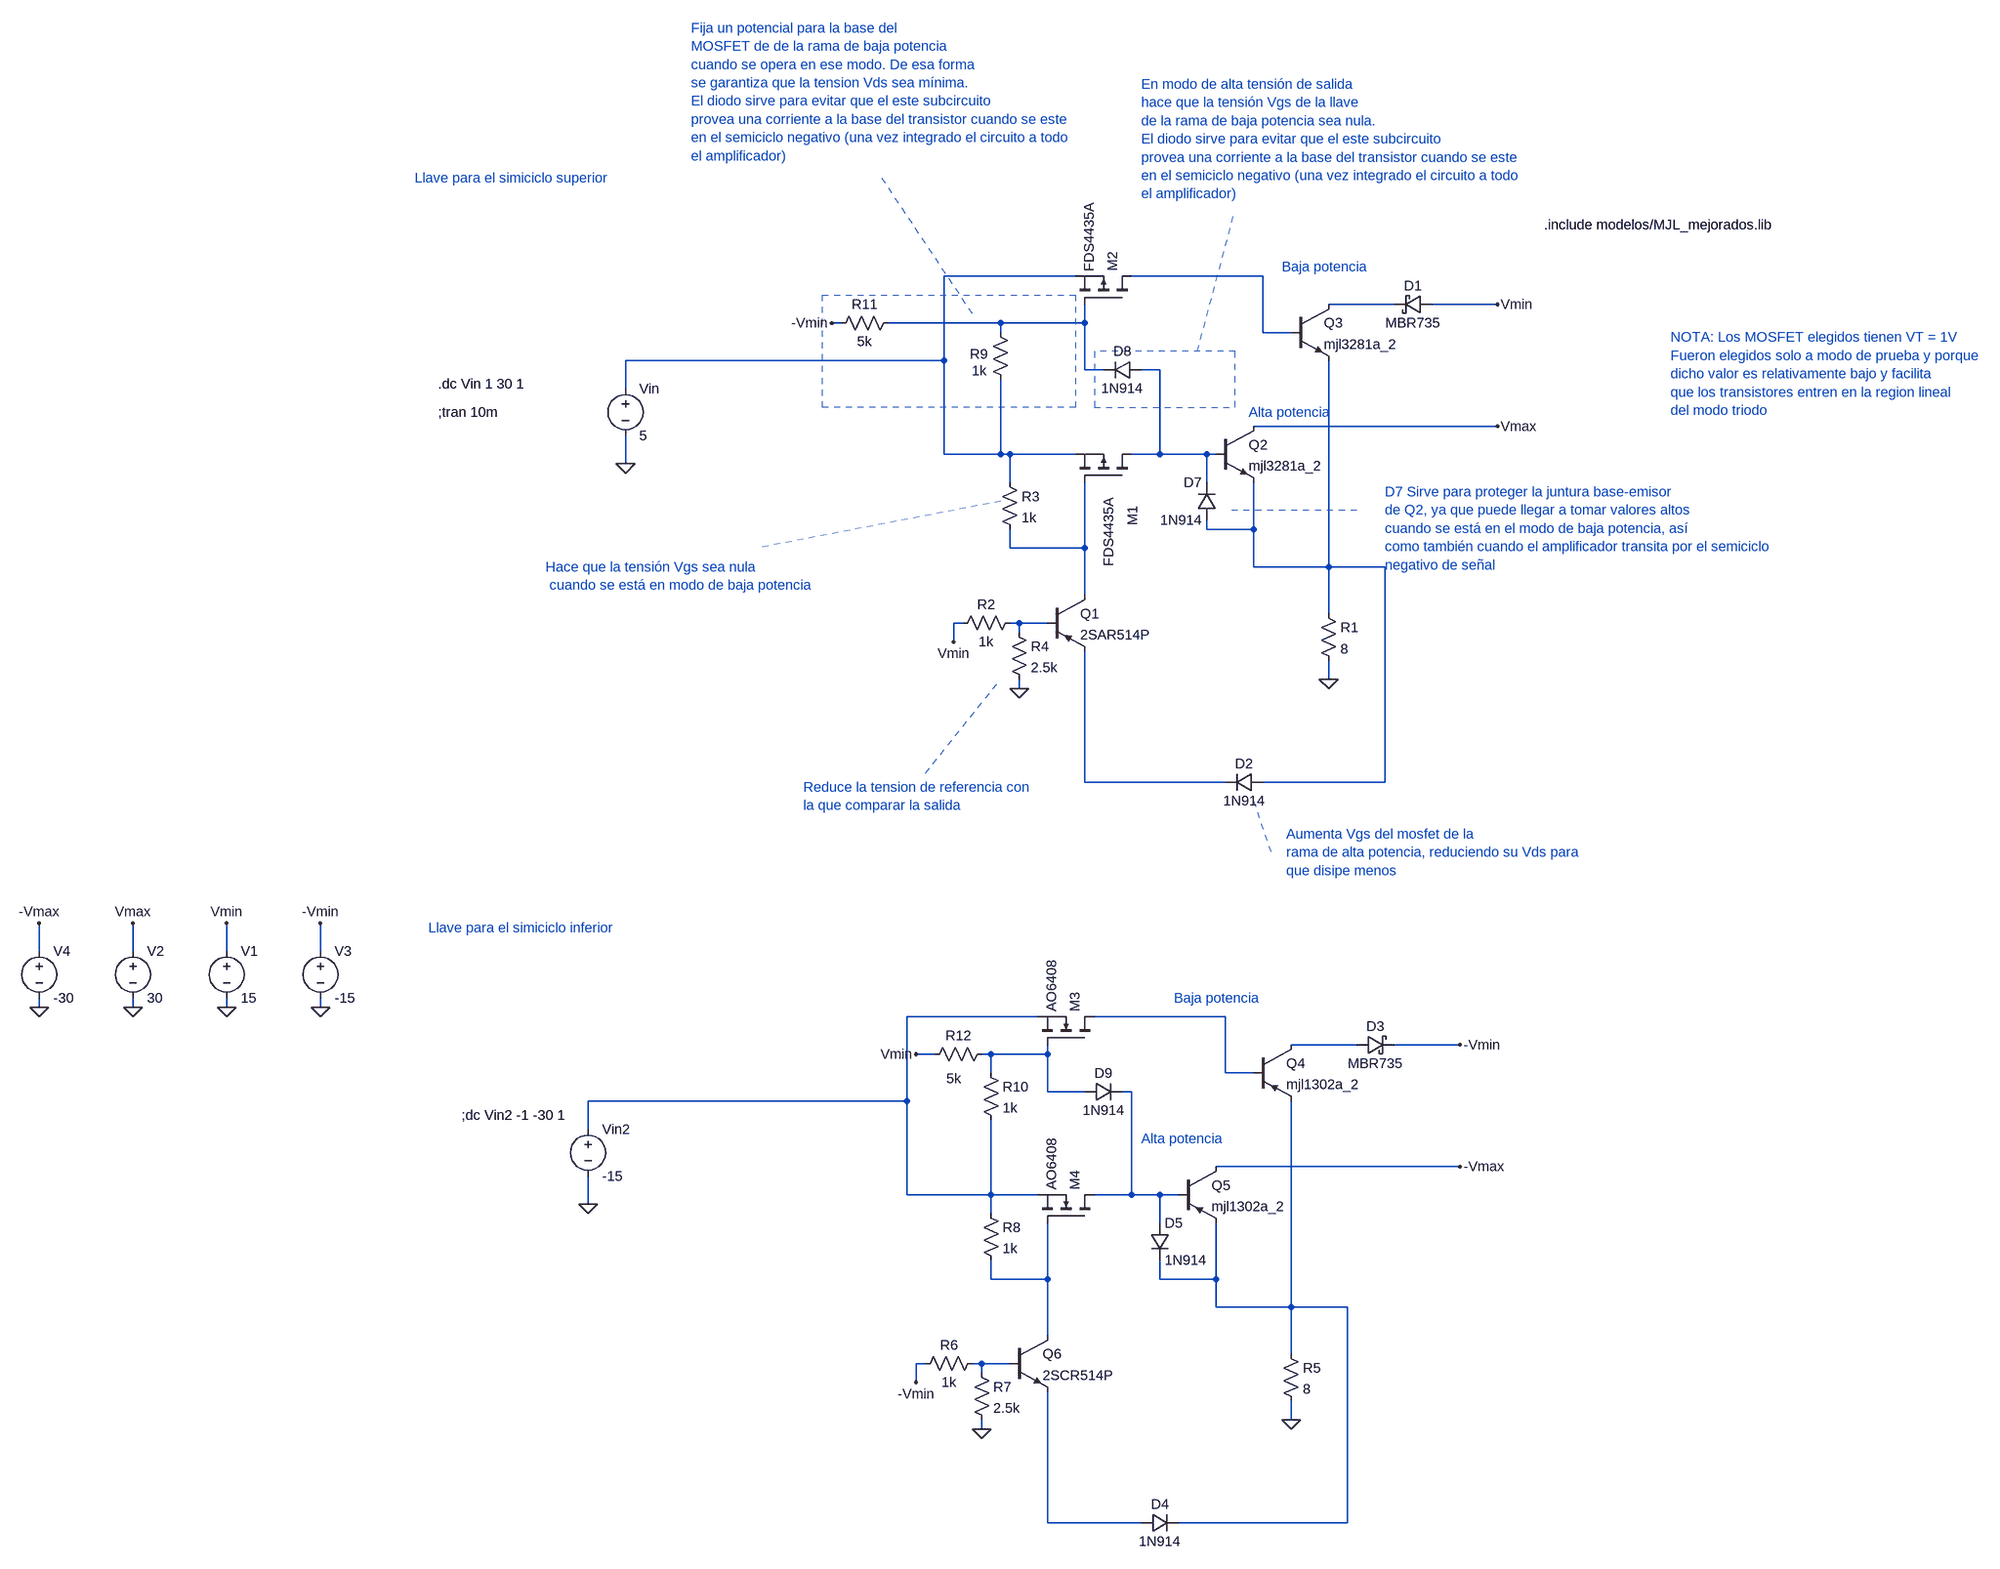
[diagram p0: schematic prueba_llaves_ambos_semiciclos.asc]
prueba_llaves_ambos_semiciclos.asc, the LTspice schematic file:
Version 4
SHEET 1 3400 1488
WIRE 1824 -688 1600 -688
WIRE 2144 -688 1920 -688
WIRE 2368 -640 2256 -640
WIRE 2544 -640 2432 -640
WIRE 1424 -608 1408 -608
WIRE 1696 -608 1504 -608
WIRE 1840 -608 1840 -640
WIRE 1840 -608 1696 -608
WIRE 1696 -592 1696 -608
WIRE 2144 -592 2144 -688
WIRE 2192 -592 2144 -592
WIRE 1600 -544 1600 -688
WIRE 1600 -544 1056 -544
WIRE 1840 -528 1840 -608
WIRE 1872 -528 1840 -528
WIRE 1968 -528 1936 -528
WIRE 1056 -496 1056 -544
WIRE 2544 -432 2128 -432
WIRE 1600 -384 1600 -544
WIRE 1696 -384 1696 -512
WIRE 1696 -384 1600 -384
WIRE 1712 -384 1696 -384
WIRE 1824 -384 1712 -384
WIRE 1968 -384 1968 -528
WIRE 1968 -384 1920 -384
WIRE 2048 -384 1968 -384
WIRE 2064 -384 2048 -384
WIRE 1056 -368 1056 -416
WIRE 1712 -336 1712 -384
WIRE 2048 -336 2048 -384
WIRE 2048 -256 2048 -272
WIRE 2128 -256 2128 -336
WIRE 2128 -256 2048 -256
WIRE 1712 -224 1712 -256
WIRE 1840 -224 1840 -336
WIRE 1840 -224 1712 -224
WIRE 2128 -192 2128 -256
WIRE 2256 -192 2256 -544
WIRE 2256 -192 2128 -192
WIRE 2352 -192 2256 -192
WIRE 1840 -144 1840 -224
WIRE 2256 -112 2256 -192
WIRE 1632 -96 1616 -96
WIRE 1728 -96 1712 -96
WIRE 1776 -96 1728 -96
WIRE 1728 -80 1728 -96
WIRE 1616 -64 1616 -96
WIRE 2256 0 2256 -32
WIRE 1728 16 1728 0
WIRE 1840 176 1840 -48
WIRE 2080 176 1840 176
WIRE 2352 176 2352 -192
WIRE 2352 176 2144 176
WIRE -128 464 -128 416
WIRE 32 464 32 416
WIRE 192 464 192 416
WIRE 352 464 352 416
WIRE -128 560 -128 544
WIRE 32 560 32 544
WIRE 192 560 192 544
WIRE 352 560 352 544
WIRE 1760 576 1536 576
WIRE 2080 576 1856 576
WIRE 2304 624 2192 624
WIRE 2480 624 2368 624
WIRE 1584 640 1552 640
WIRE 1680 640 1664 640
WIRE 1776 640 1776 624
WIRE 1776 640 1680 640
WIRE 1680 672 1680 640
WIRE 2080 672 2080 576
WIRE 2128 672 2080 672
WIRE 1776 704 1776 640
WIRE 1840 704 1776 704
WIRE 1920 704 1904 704
WIRE 1536 720 1536 576
WIRE 1536 720 992 720
WIRE 992 768 992 720
WIRE 2480 832 2064 832
WIRE 1536 880 1536 720
WIRE 1680 880 1680 752
WIRE 1680 880 1536 880
WIRE 1760 880 1680 880
WIRE 1920 880 1920 704
WIRE 1920 880 1856 880
WIRE 1968 880 1920 880
WIRE 2000 880 1968 880
WIRE 992 896 992 848
WIRE 1680 912 1680 880
WIRE 1968 928 1968 880
WIRE 1680 1024 1680 992
WIRE 1776 1024 1776 928
WIRE 1776 1024 1680 1024
WIRE 1968 1024 1968 992
WIRE 2064 1024 2064 928
WIRE 2064 1024 1968 1024
WIRE 2064 1072 2064 1024
WIRE 2192 1072 2192 720
WIRE 2192 1072 2064 1072
WIRE 2288 1072 2192 1072
WIRE 1776 1120 1776 1024
WIRE 2192 1152 2192 1072
WIRE 1568 1168 1552 1168
WIRE 1664 1168 1648 1168
WIRE 1712 1168 1664 1168
WIRE 1664 1184 1664 1168
WIRE 1552 1200 1552 1168
WIRE 2192 1264 2192 1232
WIRE 1664 1280 1664 1264
WIRE 1776 1440 1776 1216
WIRE 1936 1440 1776 1440
WIRE 2288 1440 2288 1072
WIRE 2288 1440 2000 1440
FLAG 192 560 0
FLAG 192 416 Vmin
FLAG 32 416 Vmax
FLAG 32 560 0
FLAG 352 560 0
FLAG 352 416 -Vmin
FLAG -128 416 -Vmax
FLAG -128 560 0
FLAG 2256 0 0
FLAG 1056 -368 0
FLAG 2544 -640 Vmin
FLAG 2544 -432 Vmax
FLAG 1616 -64 Vmin
FLAG 1728 16 0
FLAG 2192 1264 0
FLAG 992 896 0
FLAG 2480 624 -Vmin
FLAG 2480 832 -Vmax
FLAG 1552 1200 -Vmin
FLAG 1664 1280 0
FLAG 1408 -608 -Vmin
FLAG 1552 640 Vmin
SYMBOL voltage 192 448 R0
WINDOW 123 0 0 Left 0
WINDOW 39 0 0 Left 0
SYMATTR InstName V1
SYMATTR Value 15
SYMBOL voltage 32 448 R0
WINDOW 123 0 0 Left 0
WINDOW 39 0 0 Left 0
SYMATTR InstName V2
SYMATTR Value 30
SYMBOL voltage 352 448 R0
WINDOW 123 0 0 Left 0
WINDOW 39 0 0 Left 0
SYMATTR InstName V3
SYMATTR Value -15
SYMBOL voltage -128 448 R0
WINDOW 123 0 0 Left 0
WINDOW 39 0 0 Left 0
SYMATTR InstName V4
SYMATTR Value -30
SYMBOL pmos 1920 -336 M270
WINDOW 0 -74 -2 Left 2
WINDOW 3 -144 39 Left 2
SYMATTR InstName M1
SYMATTR Value FDS4435A
SYMBOL pmos 1920 -640 M270
SYMATTR InstName M2
SYMATTR Value FDS4435A
SYMBOL pnp 1776 -144 R0
SYMATTR InstName Q1
SYMATTR Value 2SAR514P
SYMBOL res 2240 -128 R0
SYMATTR InstName R1
SYMATTR Value 8
SYMBOL voltage 1056 -512 R0
WINDOW 123 0 0 Left 0
WINDOW 39 0 0 Left 0
SYMATTR InstName Vin
SYMATTR Value 5
SYMBOL npn 2064 -432 R0
SYMATTR InstName Q2
SYMATTR Value mjl3281a_2
SYMBOL npn 2192 -640 R0
SYMATTR InstName Q3
SYMATTR Value mjl3281a_2
SYMBOL res 1728 -112 R90
WINDOW 0 0 56 VBottom 2
WINDOW 3 32 56 VTop 2
SYMATTR InstName R2
SYMATTR Value 1k
SYMBOL res 1696 -352 R0
SYMATTR InstName R3
SYMATTR Value 1k
SYMBOL schottky 2432 -656 R90
WINDOW 0 0 32 VBottom 2
WINDOW 3 32 32 VTop 2
SYMATTR InstName D1
SYMATTR Value MBR735
SYMATTR Description Diode
SYMATTR Type diode
SYMBOL res 1712 -96 R0
SYMATTR InstName R4
SYMATTR Value 2.5k
SYMBOL res 2176 1136 R0
SYMATTR InstName R5
SYMATTR Value 8
SYMBOL voltage 992 752 R0
WINDOW 123 0 0 Left 0
WINDOW 39 0 0 Left 0
SYMATTR InstName Vin2
SYMATTR Value -15
SYMBOL res 1664 1152 R90
WINDOW 0 0 56 VBottom 2
WINDOW 3 32 56 VTop 2
SYMATTR InstName R6
SYMATTR Value 1k
SYMBOL schottky 2304 640 R270
WINDOW 0 32 32 VTop 2
WINDOW 3 0 32 VBottom 2
SYMATTR InstName D3
SYMATTR Value MBR735
SYMATTR Description Diode
SYMATTR Type diode
SYMBOL res 1648 1168 R0
SYMATTR InstName R7
SYMATTR Value 2.5k
SYMBOL pnp 2128 624 R0
SYMATTR InstName Q4
SYMATTR Value mjl1302a_2
SYMBOL pnp 2000 832 R0
SYMATTR InstName Q5
SYMATTR Value mjl1302a_2
SYMBOL nmos 1856 624 M270
SYMATTR InstName M3
SYMATTR Value AO6408
SYMBOL nmos 1856 928 M270
SYMATTR InstName M4
SYMATTR Value AO6408
SYMBOL res 1664 896 R0
SYMATTR InstName R8
SYMATTR Value 1k
SYMBOL npn 1712 1120 R0
SYMATTR InstName Q6
SYMATTR Value 2SCR514P
SYMBOL diode 2144 160 R90
WINDOW 0 0 32 VBottom 2
WINDOW 3 32 32 VTop 2
SYMATTR InstName D2
SYMATTR Value 1N914
SYMBOL res 1680 -608 R0
WINDOW 0 -36 53 Left 2
WINDOW 3 -33 81 Left 2
SYMATTR InstName R9
SYMATTR Value 1k
SYMBOL res 1664 656 R0
SYMATTR InstName R10
SYMATTR Value 1k
SYMBOL diode 1936 1456 R270
WINDOW 0 32 32 VTop 2
WINDOW 3 0 32 VBottom 2
SYMATTR InstName D4
SYMATTR Value 1N914
SYMBOL res 1520 -624 R90
WINDOW 0 0 56 VBottom 2
WINDOW 3 32 56 VTop 2
SYMATTR InstName R11
SYMATTR Value 5k
SYMBOL res 1680 624 R90
WINDOW 0 0 56 VBottom 2
WINDOW 3 42 63 VTop 2
SYMATTR InstName R12
SYMATTR Value 5k
SYMBOL diode 2064 -272 R180
WINDOW 0 24 64 Left 2
WINDOW 3 24 0 Left 2
SYMATTR InstName D7
SYMATTR Value 1N914
SYMBOL diode 1936 -544 R90
WINDOW 0 0 32 VBottom 2
WINDOW 3 32 32 VTop 2
SYMATTR InstName D8
SYMATTR Value 1N914
SYMBOL diode 1840 720 R270
WINDOW 0 32 32 VTop 2
WINDOW 3 0 32 VBottom 2
SYMATTR InstName D9
SYMATTR Value 1N914
SYMBOL diode 1952 928 R0
SYMATTR InstName D5
SYMATTR Value 1N914
TEXT 736 -456 Left 2 !;tran 10m
TEXT 2176 -704 Left 2 ;Baja potencia
TEXT 2120 -456 Left 2 ;Alta potencia
TEXT 2624 -776 Left 2 !.include modelos/MJL_mejorados.lib
TEXT 736 -504 Left 2 !.dc Vin 1 30 1
TEXT 1992 544 Left 2 ;Baja potencia
TEXT 1936 784 Left 2 ;Alta potencia
TEXT 776 744 Left 2 !;dc Vin2 -1 -30 1
TEXT 696 -856 Left 2 ;Llave para el simiciclo superior
TEXT 720 424 Left 2 ;Llave para el simiciclo inferior
TEXT 1360 184 Left 2 ;Reduce la tension de referencia con\nla que comparar la salida
TEXT 920 -192 Left 2 ;Hace que la tensión Vgs sea nula\n cuando se está en modo de baja potencia
TEXT 1936 -1016 Left 2 ;En modo de alta tensión de salida\nhace que la tensión Vgs de la llave\nde la rama de baja potencia sea nula.\nEl diodo sirve para evitar que el este subcircuito\nprovea una corriente a la base del transistor cuando se este\nen el semiciclo negativo (una vez integrado el circuito a todo\nel amplificador)
TEXT 2184 264 Left 2 ;Aumenta Vgs del mosfet de la\nrama de alta potencia, reduciendo su Vds para\nque disipe menos
TEXT 1168 -1112 Left 2 ;Fija un potencial para la base del\nMOSFET de de la rama de baja potencia\ncuando se opera en ese modo. De esa forma\nse garantiza que la tension Vds sea mínima.\nEl diodo sirve para evitar que el este subcircuito\nprovea una corriente a la base del transistor cuando se este\nen el semiciclo negativo (una vez integrado el circuito a todo\nel amplificador)
TEXT 2840 -584 Left 2 ;NOTA: Los MOSFET elegidos tienen VT = 1V\nFueron elegidos solo a modo de prueba y porque\ndicho valor es relativamente bajo y facilita\nque los transistores entren en la region lineal\ndel modo triodo
TEXT 2352 -320 Left 2 ;D7 Sirve para proteger la juntura base-emisor\nde Q2, ya que puede llegar a tomar valores altos\ncuando se está en el modo de baja potencia, así\ncomo también cuando el amplificador transita por el semiciclo\nnegativo de señal
LINE Normal 1568 160 1696 0 2
LINE Normal 1696 -304 1280 -224 2
LINE Normal 1648 -624 1488 -864 2
LINE Normal 2128 208 2160 304 2
LINE Normal 2032 -560 2096 -800 2
LINE Normal 2304 -288 2080 -288 2
RECTANGLE Normal 1856 -464 2096 -560 2
RECTANGLE Normal 1824 -464 1392 -656 2

The netlist it stands for:
* prueba_llaves_ambos_semiciclos.asc
V1 Vmin 0 15
V2 Vmax 0 30
V3 -Vmin 0 -15
V4 -Vmax 0 -30
M1 N005 N007 N001 N001 FDS4435A
M2 N002 N004 N001 N001 FDS4435A
Q1 N007 N008 N009 0 2SAR514P
R1 N006 0 8
Vin N001 0 5
Q2 Vmax N005 N006 0 mjl3281a_2
Q3 N003 N002 N006 0 mjl3281a_2
R2 N008 Vmin 1k
R3 N001 N007 1k
D1 Vmin N003 MBR735
R4 N008 0 2.5k
R5 N016 0 8
Vin2 N010 0 -15
R6 N017 -Vmin 1k
D3 N012 -Vmin MBR735
R7 N017 0 2.5k
Q4 N012 N011 N016 0 mjl1302a_2
Q5 -Vmax N014 N016 0 mjl1302a_2
M3 N011 N013 N010 N010 AO6408
M4 N014 N015 N010 N010 AO6408
R8 N010 N015 1k
Q6 N015 N017 N018 0 2SCR514P
D2 N006 N009 1N914
R9 N004 N001 1k
R10 N013 N010 1k
D4 N018 N016 1N914
R11 N004 -Vmin 5k
R12 N013 Vmin 5k
D7 N006 N005 1N914
D8 N005 N004 1N914
D9 N013 N014 1N914
D5 N014 N016 1N914
.model D D
.lib standard.dio
.model NPN NPN
.model PNP PNP
.lib standard.bjt
.model NMOS NMOS
.model PMOS PMOS
.lib standard.mos
;tran 10m
* Baja potencia
* Alta potencia
.include modelos/MJL_mejorados.lib
.dc Vin 1 30 1
* Baja potencia
* Alta potencia
;dc Vin2 -1 -30 1
* Llave para el simiciclo superior
* Llave para el simiciclo inferior
* Reduce la tension de referencia con
* la que comparar la salida
* Hace que la tensión Vgs sea nula
*  cuando se está en modo de baja potencia
* En modo de alta tensión de salida
* hace que la tensión Vgs de la llave
* de la rama de baja potencia sea nula.
* El diodo sirve para evitar que el este subcircuito
* provea una corriente a la base del transistor cuando se este
* en el semiciclo negativo (una vez integrado el circuito a todo
* el amplificador)
* Aumenta Vgs del mosfet de la
* rama de alta potencia, reduciendo su Vds para
* que disipe menos
* Fija un potencial para la base del
* MOSFET de de la rama de baja potencia
* cuando se opera en ese modo. De esa forma
* se garantiza que la tension Vds sea mínima.
* El diodo sirve para evitar que el este subcircuito
* provea una corriente a la base del transistor cuando se este
* en el semiciclo negativo (una vez integrado el circuito a todo
* el amplificador)
* NOTA: Los MOSFET elegidos tienen VT = 1V
* Fueron elegidos solo a modo de prueba y porque
* dicho valor es relativamente bajo y facilita
* que los transistores entren en la region lineal
* del modo triodo
* D7 Sirve para proteger la juntura base-emisor
* de Q2, ya que puede llegar a tomar valores altos
* cuando se está en el modo de baja potencia, así
* como también cuando el amplificador transita por el semiciclo
* negativo de señal
.backanno
.end